# Altium schematic sheet TopSheet.SchDoc
size A4; Website: www.ultrazohm.com; CompanyName: Technische Hochschule Nürnberg Georg Simon Ohm; Address1: Fürther Straße 250; Address2: 90429 Nürnberg; Address3: GERMANY; SheetNumber: 1; SheetTotal: 5; CompanyName2: Institut ELSYS
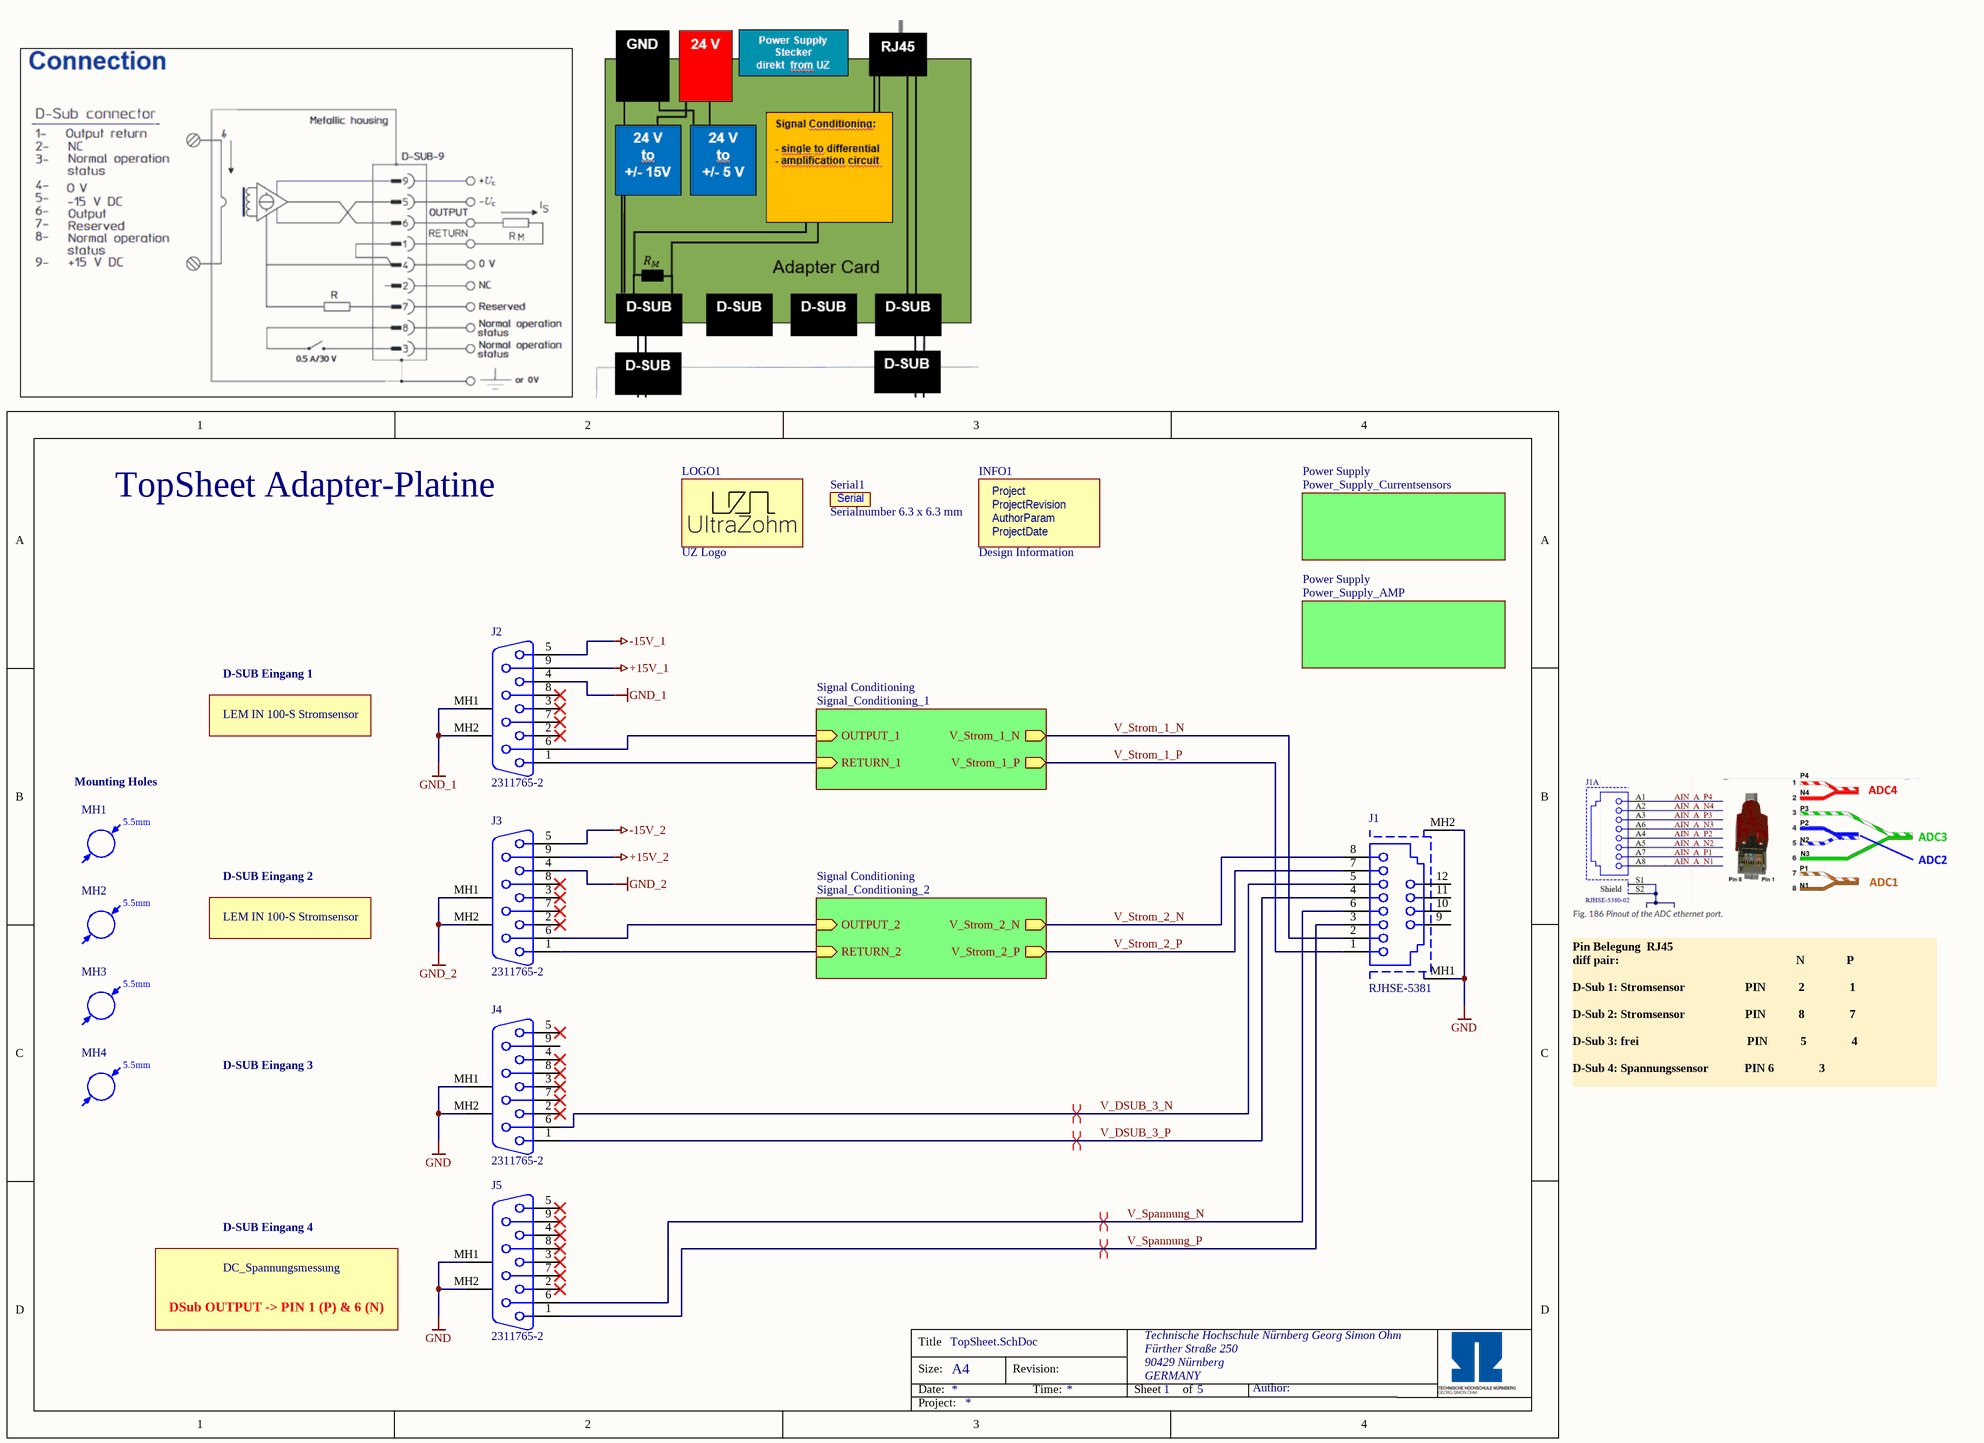
[diagram p0: TopSheet.SchDoc]

## Parts
INFO1  Design Information  [Design_info]  (no BOM)
J1  RJHSE-5381  [RJHSE-5381]
J2  2311765-2  [23117652]
J3  2311765-2  [23117652]
J4  2311765-2  [23117652]
J5  2311765-2  [23117652]
LOGO1  UZ Logo  [UZ_Logo_small]  (no BOM)
MH1  Mounting_Hole_M5  [Mounting Hole (M5)]  (value not drawn)
MH2  Mounting_Hole_M5  [Mounting Hole (M5)]  (value not drawn)
MH3  Mounting_Hole_M5  [Mounting Hole (M5)]  (value not drawn)
MH4  Mounting_Hole_M5  [Mounting Hole (M5)]  (value not drawn)
Serial1  Serialnumber 6.3 x 6.3 mm  [SERIAL_6.3X6.3MM]  (no BOM)

## Sub-sheets
Power Supply = Power_Supply_Currentsensors: no entries
Power Supply = Power_Supply_AMP: no entries
Signal Conditioning = Signal_Conditioning_1: RETURN_1 (in), OUTPUT_1 (in), V_Strom_1_N (out), V_Strom_1_P (out)
Signal Conditioning = Signal_Conditioning_2: RETURN_2 (in), OUTPUT_2 (in), V_Strom_2_N (out), V_Strom_2_P (out)

## Nets
+15V_1: J2.9
+15V_2: J3.9
-15V_1: J2.5
-15V_2: J3.5
GND: J1.MH1(Shell) J1.MH2(Shell) J4.MH1 J4.MH2 J5.MH1 J5.MH2
GND_1: J2.4 J2.MH1 J2.MH2
GND_2: J3.4 J3.MH1 J3.MH2
V_DSUB_3_N: J1.5 J4.6
V_DSUB_3_P: J1.4 J4.1
V_Spannung_N: J1.6 J5.6
V_Spannung_P: J1.3 J5.1
V_Strom_1_N: J1.2 ; sheet Signal Conditioning/V_Strom_1_N
V_Strom_1_P: J1.1 ; sheet Signal Conditioning/V_Strom_1_P
V_Strom_2_N: J1.8 ; sheet Signal Conditioning/V_Strom_2_N
V_Strom_2_P: J1.7 ; sheet Signal Conditioning/V_Strom_2_P
NetJ2_1: J2.1 ; sheet Signal Conditioning/RETURN_1
NetJ2_6: J2.6 ; sheet Signal Conditioning/OUTPUT_1
NetJ3_1: J3.1 ; sheet Signal Conditioning/RETURN_2
NetJ3_6: J3.6 ; sheet Signal Conditioning/OUTPUT_2

Not connected (* = marked no-connect by the designer): J1 9(8) 10(8) 11(8) 12(8); J2 2* 3* 7* 8*; J3 2* 3* 7* 8*; J4 2* 3* 4* 5* 7* 8* 9; J5 2* 3* 4* 5* 7* 8* 9*

## Layout directives
differential pair: V_DSUB_3_N, V_DSUB_3_P, V_Spannung_N, V_Spannung_P

## Notes on the sheet
- TopSheet Adapter-Platine
- D-SUB Eingang 1
- LEM IN 100-S Stromsensor
- Mounting Holes
- D-SUB Eingang 2
- D-SUB Eingang 3
- Pin Belegung  RJ45
  diff pair:                                                           N              P
  D-Sub 1: Stromsensor                    PIN           2               1
  D-Sub 2: Stromsensor                    PIN           8               7
  D-Sub 3: frei                                    PIN           5               4
  D-Sub 4: Spannungssensor            PIN	6               3
- D-SUB Eingang 4
- DSub OUTPUT -> PIN 1 (P) & 6 (N)
- DC_Spannungsmessung
- Title
- Size:
- Date:
- A4
- Revision:
- Time:
- Sheet
- of
- Author:
- Project:
- (in symbol Design Information) Project; ProjectRevision; AuthorParam; ProjectDate
- (in symbol Mounting_Hole_M5) 5.5mm
- (in symbol Serial Number) Serial

## Library data of the parts
INFO1 = Design Information: Design InformationS; Manufacturer: UltraZohm; Created from: MGremer; Manufacturer Part Number: Design Information; PartID: 12; Created On: 03.11.2021 09:04:23; ComponentLink1Description: https://docs.ultrazohm.com/; ComponentLink1URL: homepage; Component Type: Design Information; Last Updated: 03.11.2021 09:28:34; Supplier 1: -; Supplier Part Number 1: -; Type: Design Information; Value: Design Information; Live Cycle Status: 1
J1 = RJHSE-5381: Connector Ethernet R/A RJ45 SHIELDED 8 CONT Y/G LEDS; Supplier 1: Mouser; Supplier Part Number 1: 523-RJHSE-5381
J2-J5 = 2311765-2: Connector D-Sub 9 Pin Female; Manufacturer_Name: TE Connectivity; Datasheet Link: https://www.te.com/commerce/DocumentDelivery/DDEController?Action=showdoc&DocId=Customer+Drawing%7F2311765%7FD%7Fpdf%7FEnglish%7FENG_CD_2311765_D.pdf%7F2311765-2; Height: 12.8mm; Manufacturer_Part_Number: 2311765-2; Mouser Part Number: 571-2311765-2; Mouser Price/Stock: https://www.mouser.co.uk/ProductDetail/TE-Connectivity/2311765-2?qs=rrS6PyfT74frdzrH7SJRfg%3D%3D; Arrow Part Number: 2311765-2; Arrow Price/Stock: https://www.arrow.com/en/products/2311765-2/te-connectivity?region=nac
  J2: Supplier 1: Mouser; Supplier Part Number 1: 571-2311765-2
LOGO1 = Logo small: Manufacturer: UltraZohm; Created from: MGremer; Created: Jan2021_Liegmann; Value: Logo; Manufacturer Part Number: Logo small; PartID: 10; Created On: 03.11.2021 09:04:23; ComponentLink1Description: https://docs.ultrazohm.com/; ComponentLink1URL: homepage; Component Type: Logo; Last Updated: 03.11.2021 09:05:50; Supplier 1: -; Supplier Part Number 1: -; Type: Logo; Live Cycle Status: 1
MH1-MH4 = Mounting_Hole_M5: Mounting Hole
Serial1 = Serial Number: Manufacturer: UltraZohm; Value: REV; Created from: MGremer; Created: 2018_09_18_AGeiger; Manufacturer Part Number: Serial Number; PartID: 11; Created On: 03.11.2021 09:04:23; ComponentLink1Description: https://docs.ultrazohm.com/; ComponentLink1URL: homepage; Component Type: Serial Number; Last Updated: 03.11.2021 09:28:34; Supplier 1: -; Supplier Part Number 1: -; Type: Serial Number; Live Cycle Status: 1